# Altium schematic sheet MAGI'sDIPBoard-2x.SchDoc
size A4
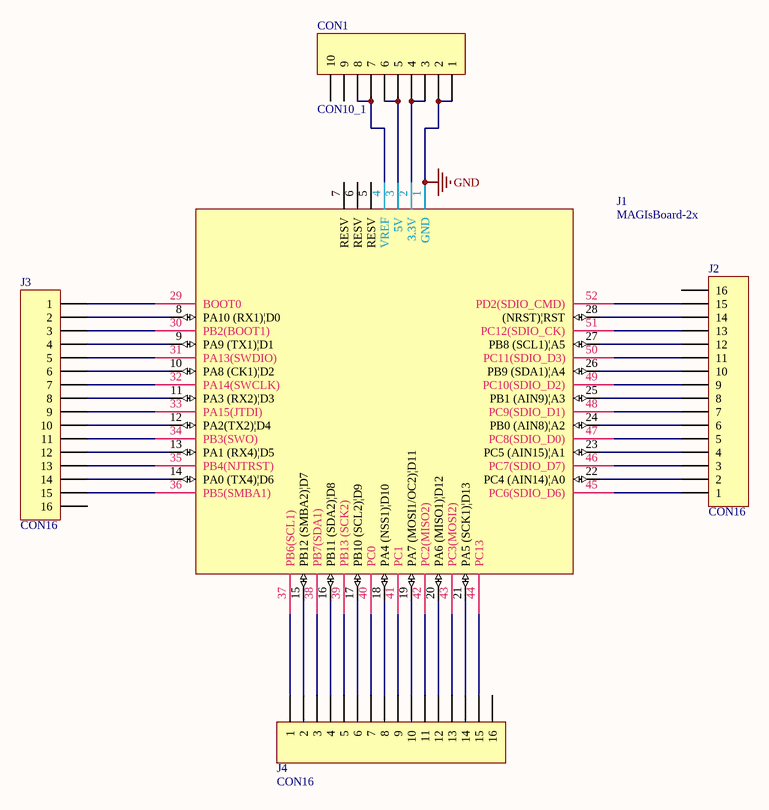
[diagram p0: MAGI'sDIPBoard-2x.SchDoc]

## Parts
CON1  CON10_1  [idc10]
J1  MAGIsBoard-2x  [MAGIsBoard-2x]
J2  CON16  [idc16]
J3  CON16  [idc16]
J4  CON16  [idc16]

## Nets
GND: CON1.1 CON1.2 J1.1(GND)
NetCON1_3: CON1.3 CON1.4 J1.2(3.3V)
NetCON1_5: CON1.5 CON1.6 J1.3(5V)
NetCON1_7: CON1.7 CON1.8 J1.4(VREF)
NetJ1_8: J1.8(PA10_(RX1)|D0) J3.2
NetJ1_9: J1.9(PA9_(TX1)|D1) J3.4
NetJ1_10: J1.10(PA8_(CK1)|D2) J3.6
NetJ1_11: J1.11(PA3_(RX2)|D3) J3.8
NetJ1_12: J1.12(PA2(TX2)|D4) J3.10
NetJ1_13: J1.13(PA1_(RX4)|D5) J3.12
NetJ1_14: J1.14(PA0_(TX4)|D6) J3.14
NetJ1_15: J1.15(PB12_(SMBA2)|D7) J4.2
NetJ1_16: J1.16(PB11_(SDA2)|D8) J4.4
NetJ1_17: J1.17(PB10_(SCL2)|D9) J4.6
NetJ1_18: J1.18(PA4_(NSS1)|D10) J4.8
NetJ1_19: J1.19(PA7_(MOSI1/OC2)|D11) J4.10
NetJ1_20: J1.20(PA6_(MISO1)|D12) J4.12
NetJ1_21: J1.21(PA5_(SCK1)|D13) J4.14
NetJ1_22: J1.22(PC4_(AIN14)|A0) J2.2
NetJ1_23: J1.23(PC5_(AIN15)|A1) J2.4
NetJ1_24: J1.24(PB0_(AIN8)|A2) J2.6
NetJ1_25: J1.25(PB1_(AIN9)|A3) J2.8
NetJ1_26: J1.26(PB9_(SDA1)|A4) J2.10
NetJ1_27: J1.27(PB8_(SCL1)|A5) J2.12
NetJ1_28: J1.28((NRST)|RST) J2.14
NetJ1_29: J1.29(BOOT0) J3.1
NetJ1_30: J1.30(PB2(BOOT1)) J3.3
NetJ1_31: J1.31(PA13(SWDIO)) J3.5
NetJ1_32: J1.32(PA14(SWCLK)) J3.7
NetJ1_33: J1.33(PA15(JTDI)) J3.9
NetJ1_34: J1.34(PB3(SWO)) J3.11
NetJ1_35: J1.35(PB4(NJTRST)) J3.13
NetJ1_36: J1.36(PB5(SMBA1)) J3.15
NetJ1_37: J1.37(PB6(SCL1)) J4.1
NetJ1_38: J1.38(PB7(SDA1)) J4.3
NetJ1_39: J1.39(PB13_(SCK2)) J4.5
NetJ1_40: J1.40(PC0) J4.7
NetJ1_41: J1.41(PC1) J4.9
NetJ1_42: J1.42(PC2(MISO2)) J4.11
NetJ1_43: J1.43(PC3(MOSI2)) J4.13
NetJ1_44: J1.44(PC13) J4.15
NetJ1_45: J1.45(PC6(SDIO_D6)) J2.1
NetJ1_46: J1.46(PC7(SDIO_D7)) J2.3
NetJ1_47: J1.47(PC8(SDIO_D0)) J2.5
NetJ1_48: J1.48(PC9(SDIO_D1)) J2.7
NetJ1_49: J1.49(PC10(SDIO_D2)) J2.9
NetJ1_50: J1.50(PC11(SDIO_D3)) J2.11
NetJ1_51: J1.51(PC12(SDIO_CK)) J2.13
NetJ1_52: J1.52(PD2(SDIO_CMD)) J2.15

Not connected (* = marked no-connect by the designer): CON1 9 10; J1 5(RESV) 6(RESV) 7(RESV); J2 16; J3 16; J4 16

## Library data of the parts
CON1 = CON10_1: Connector
J2-J4 = CON16: Connector